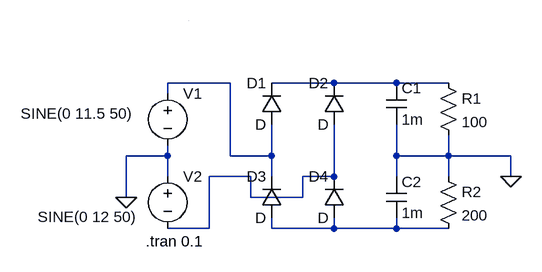
[diagram p0: schematic tranny_dc_bias.asc]
tranny_dc_bias.asc, the LTspice schematic file:
Version 4
SHEET 1 880 680
WIRE 64 96 -32 96
WIRE 224 96 128 96
WIRE 320 96 224 96
WIRE 400 96 320 96
WIRE -32 112 -32 96
WIRE -32 208 -32 192
WIRE -32 208 -96 208
WIRE 64 208 64 96
WIRE 128 208 128 160
WIRE 128 208 64 208
WIRE 320 208 320 160
WIRE 400 208 400 176
WIRE 400 208 320 208
WIRE 496 208 400 208
WIRE -32 240 -32 208
WIRE 96 240 32 240
WIRE 128 240 128 208
WIRE 224 240 224 160
WIRE 224 240 176 240
WIRE 320 240 320 208
WIRE 400 240 400 208
WIRE 496 240 496 208
WIRE -96 272 -96 208
WIRE 96 272 96 240
WIRE 176 272 176 240
WIRE 176 272 96 272
WIRE 32 320 32 240
WIRE 32 320 -32 320
WIRE 128 320 128 304
WIRE 224 320 224 304
WIRE 224 320 128 320
WIRE 320 320 320 304
WIRE 320 320 224 320
WIRE 400 320 320 320
WIRE 0 0 0 0
FLAG -96 272 0
FLAG 496 240 0
SYMBOL diode 144 160 R180
WINDOW 0 24 64 Left 2
WINDOW 3 24 0 Left 2
SYMATTR InstName D1
SYMBOL diode 240 160 R180
WINDOW 0 24 64 Left 2
WINDOW 3 24 0 Left 2
SYMATTR InstName D2
SYMBOL diode 144 304 R180
WINDOW 0 24 64 Left 2
WINDOW 3 24 0 Left 2
SYMATTR InstName D3
SYMBOL diode 240 304 R180
WINDOW 0 24 64 Left 2
WINDOW 3 24 0 Left 2
SYMATTR InstName D4
SYMBOL cap 304 96 R0
SYMATTR InstName C1
SYMATTR Value 1m
SYMBOL cap 304 240 R0
SYMATTR InstName C2
SYMATTR Value 1m
SYMBOL voltage -32 96 R0
WINDOW 3 -226 47 Left 2
WINDOW 123 0 0 Left 0
WINDOW 39 0 0 Left 0
SYMATTR InstName V1
SYMATTR Value SINE(0 11.5 50)
SYMBOL voltage -32 224 R0
WINDOW 3 -200 78 Left 2
WINDOW 123 0 0 Left 0
WINDOW 39 0 0 Left 0
SYMATTR InstName V2
SYMATTR Value SINE(0 12 50)
SYMBOL res 384 80 R0
SYMATTR InstName R1
SYMATTR Value 100
SYMBOL res 384 224 R0
SYMATTR InstName R2
SYMATTR Value 200
TEXT -66 340 Left 2 !.tran 0.1

The netlist it stands for:
* tranny_dc_bias.asc
D1 N001 N002 D
D2 N003 N002 D
D3 N004 N001 D
D4 N004 N003 D
C1 N002 0 1m
C2 0 N004 1m
V1 N001 0 SINE(0 11.5 50)
V2 0 N003 SINE(0 12 50)
R1 N002 0 100
R2 0 N004 200
.model D D
.lib standard.dio
.tran 0.1
.backanno
.end